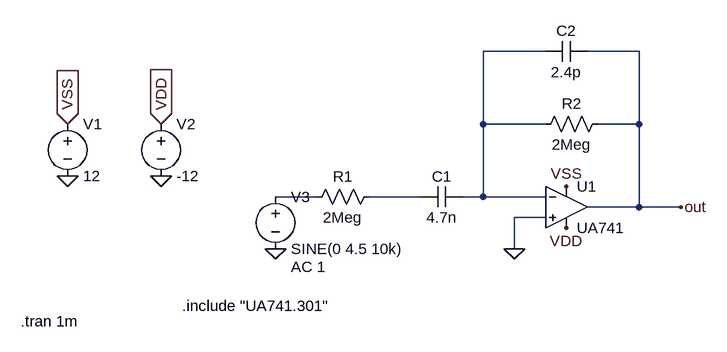
[diagram p0: schematic Band pass filter.asc]
Band pass filter.asc, the LTspice schematic file:
Version 4.1
SHEET 1 880 680
WIRE 176 -80 80 -80
WIRE 320 -80 240 -80
WIRE 80 32 80 -80
WIRE 176 32 80 32
WIRE 320 32 320 -80
WIRE 320 32 256 32
WIRE -176 144 -240 144
WIRE -16 144 -96 144
WIRE 80 144 80 32
WIRE 80 144 48 144
WIRE 176 144 80 144
WIRE 320 160 320 32
WIRE 320 160 240 160
WIRE 384 160 320 160
WIRE 176 176 128 176
WIRE 128 224 128 176
FLAG 128 224 0
FLAG -560 112 0
FLAG -416 112 0
FLAG -560 32 VSS
IOPIN -560 32 In
FLAG -416 32 VDD
IOPIN -416 32 In
FLAG 208 128 VSS
FLAG 208 192 VDD
FLAG -240 224 0
FLAG 384 160 out
SYMBOL res 272 16 R90
WINDOW 0 0 56 VBottom 2
WINDOW 3 32 56 VTop 2
SYMATTR InstName R2
SYMATTR Value 2Meg
SYMBOL res -80 128 R90
WINDOW 0 0 56 VBottom 2
WINDOW 3 32 56 VTop 2
SYMATTR InstName R1
SYMATTR Value 2Meg
SYMBOL cap 48 128 R90
WINDOW 0 0 32 VBottom 2
WINDOW 3 32 32 VTop 2
SYMATTR InstName C1
SYMATTR Value 4.7n
SYMBOL cap 240 -96 R90
WINDOW 0 0 32 VBottom 2
WINDOW 3 32 32 VTop 2
SYMATTR InstName C2
SYMATTR Value 2.4p
SYMBOL OpAmps\\opamp2 208 96 R0
SYMATTR InstName U1
SYMATTR Value UA741
SYMBOL voltage -560 16 R0
WINDOW 123 0 0 Left 0
WINDOW 39 0 0 Left 0
SYMATTR InstName V1
SYMATTR Value 12
SYMBOL voltage -416 16 R0
WINDOW 123 0 0 Left 0
WINDOW 39 0 0 Left 0
SYMATTR InstName V2
SYMATTR Value -12
SYMBOL voltage -240 128 R0
WINDOW 123 24 124 Left 2
WINDOW 39 0 0 Left 0
SYMATTR Value2 AC 1
SYMATTR InstName V3
SYMATTR Value SINE(0 4.5 10k)
TEXT -384 312 Left 2 !.include "UA741.301"
TEXT -632 336 Left 2 !.tran 1m

The netlist it stands for:
* Band pass filter.asc
R2 out N001 2Meg
R1 N003 N002 2Meg
C1 N001 N003 4.7n
C2 out N001 2.4p
X§U1 0 N001 VSS VDD out UA741  ; pins In+ In- V+ V- OUT
V1 VSS 0 12
V2 VDD 0 -12
V3 N002 0 SINE(0 4.5 10k) AC 1
.include "UA741.301"
.tran 1m
.backanno
.end